# Altium schematic sheet KEY.SchDoc
size A
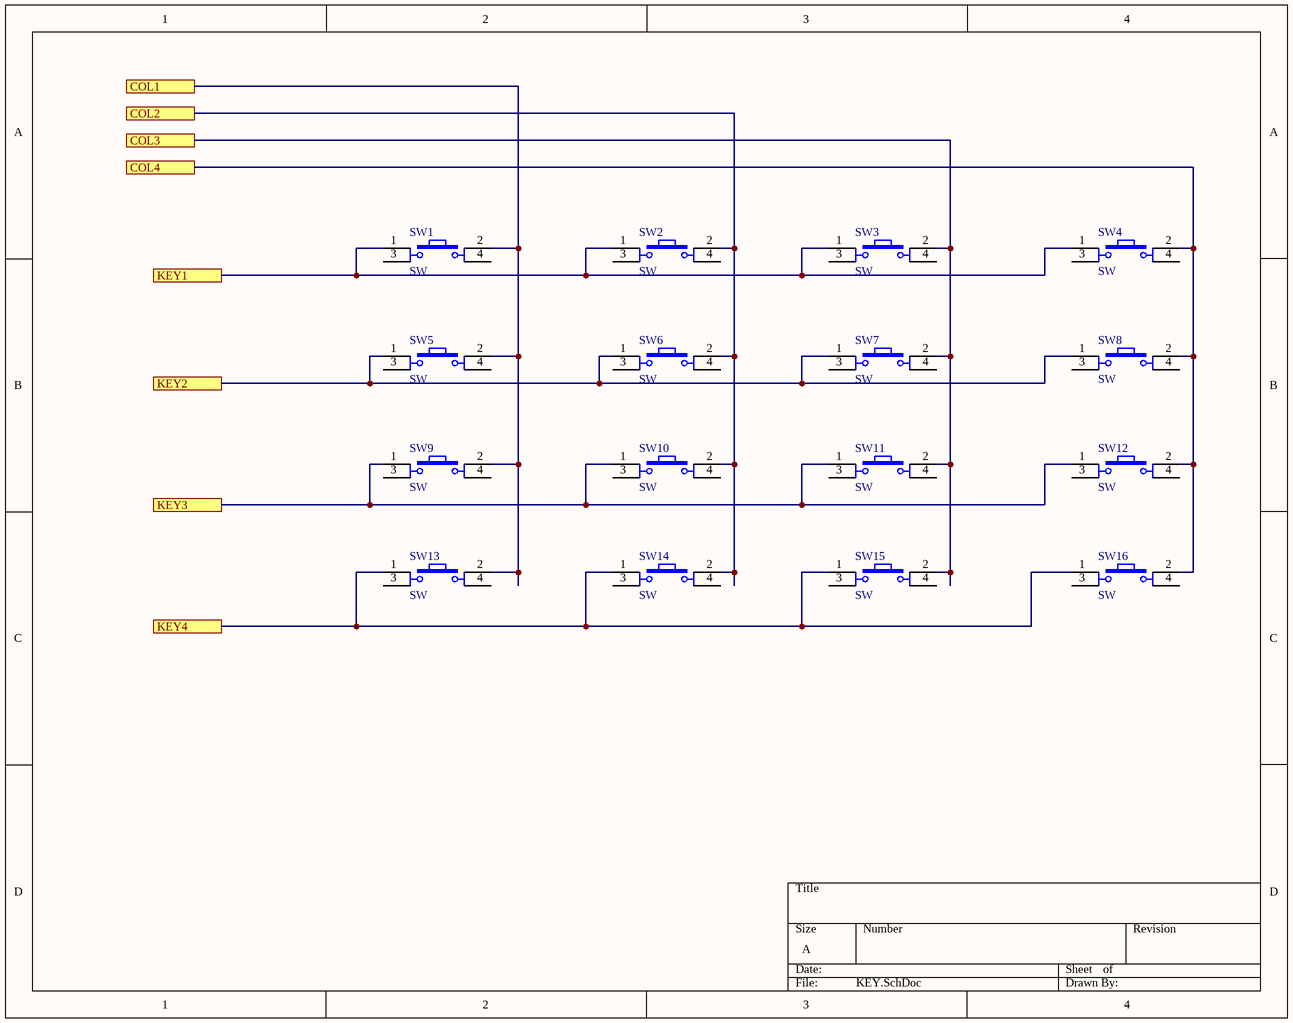
[diagram p0: KEY.SchDoc]

## Parts
SW1  SW  [SW4B_SMD]
SW2  SW  [SW4B_SMD]
SW3  SW  [SW4B_SMD]
SW4  SW  [SW4B_SMD]
SW5  SW  [SW4B_SMD]
SW6  SW  [SW4B_SMD]
SW7  SW  [SW4B_SMD]
SW8  SW  [SW4B_SMD]
SW9  SW  [SW4B_SMD]
SW10  SW  [SW4B_SMD]
SW11  SW  [SW4B_SMD]
SW12  SW  [SW4B_SMD]
SW13  SW  [SW4B_SMD]
SW14  SW  [SW4B_SMD]
SW15  SW  [SW4B_SMD]
SW16  SW  [SW4B_SMD]

## Ports
COL1, COL2, COL3, COL4, KEY1, KEY2, KEY3, KEY4

## Nets
COL1: SW1.2 SW5.2 SW9.2 SW13.2 ; port COL1
COL2: SW2.2 SW6.2 SW10.2 SW14.2 ; port COL2
COL3: SW3.2 SW7.2 SW11.2 SW15.2 ; port COL3
COL4: SW4.2 SW8.2 SW12.2 SW16.2 ; port COL4
KEY1: SW1.1 SW2.1 SW3.1 SW4.1 ; port KEY1
KEY2: SW5.1 SW6.1 SW7.1 SW8.1 ; port KEY2
KEY3: SW9.1 SW10.1 SW11.1 SW12.1 ; port KEY3
KEY4: SW13.1 SW14.1 SW15.1 SW16.1 ; port KEY4

Not connected (* = marked no-connect by the designer): SW1 3 4; SW2 3 4; SW3 3 4; SW4 3 4; SW5 3 4; SW6 3 4; SW7 3 4; SW8 3 4; SW9 3 4; SW10 3 4; SW11 3 4; SW12 3 4; SW13 3 4; SW14 3 4; SW15 3 4; SW16 3 4

## Library data of the parts
SW1-SW16 = SW4: Switch button 4 pin; Value: Button chip 4 pin